# Altium schematic sheet Power_SET.SchDoc
size A4; SheetNumber: 4; SheetTotal: 4
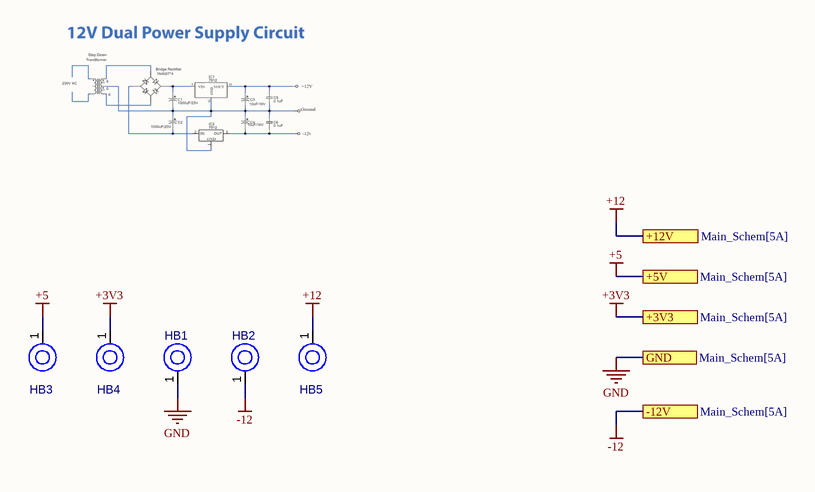
[diagram p0: Power_SET.SchDoc]

## Parts
HB1  PTH-M2D5X5  [PTH-M2D5X5]  (value not drawn)
HB2  PTH-M2D5X5  [PTH-M2D5X5]  (value not drawn)
HB3  PTH-M2D5X5  [PTH-M2D5X5]  (value not drawn)
HB4  PTH-M2D5X5  [PTH-M2D5X5]  (value not drawn)
HB5  PTH-M2D5X5  [PTH-M2D5X5]  (value not drawn)

## Ports
+3V3 (see Main_Schem[5A]), +5V (see Main_Schem[5A]), +12V (see Main_Schem[5A]), -12V (see Main_Schem[5A]), GND (see Main_Schem[5A])

## Nets
+3V3: HB4.1(H1) ; port +3V3
+5: HB3.1(H1) ; port +5V
+12: HB5.1(H1) ; port +12V
-12: HB2.1(H1) ; port -12V
GND: HB1.1(H1) ; port GND

## Library data of the parts
HB1-HB5 = CMP-00028-00004-2: M2 PTH (2.5mm), 5mm pad; Pins: 1